# Altium schematic sheet Title.SchDoc: Title Page
size Letter; SheetNumber: 1; SheetTotal: 12
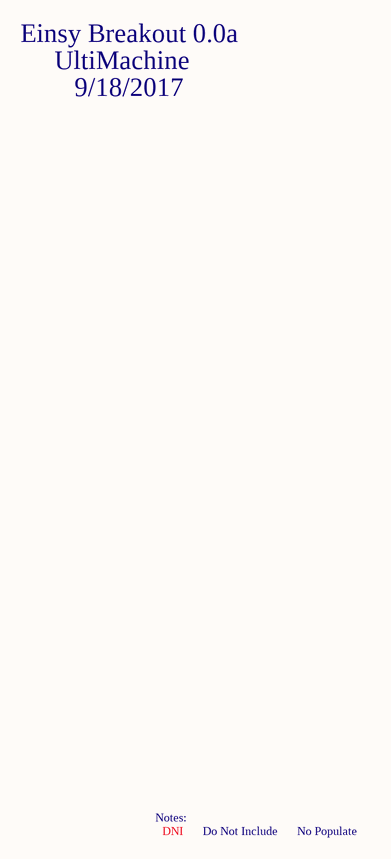
[diagram p0: Title.SchDoc]

## Notes on the sheet
- Einsy Breakout 0.0a
- UltiMachine
- 9/18/2017
- Notes:
- DNI
- Do Not Include
- No Populate
- Title:
- Project:
- File:
- Ver:
- Drawn by:
- Sheet:
- of